# Altium schematic sheet [01] - MC.SchDoc
size A3
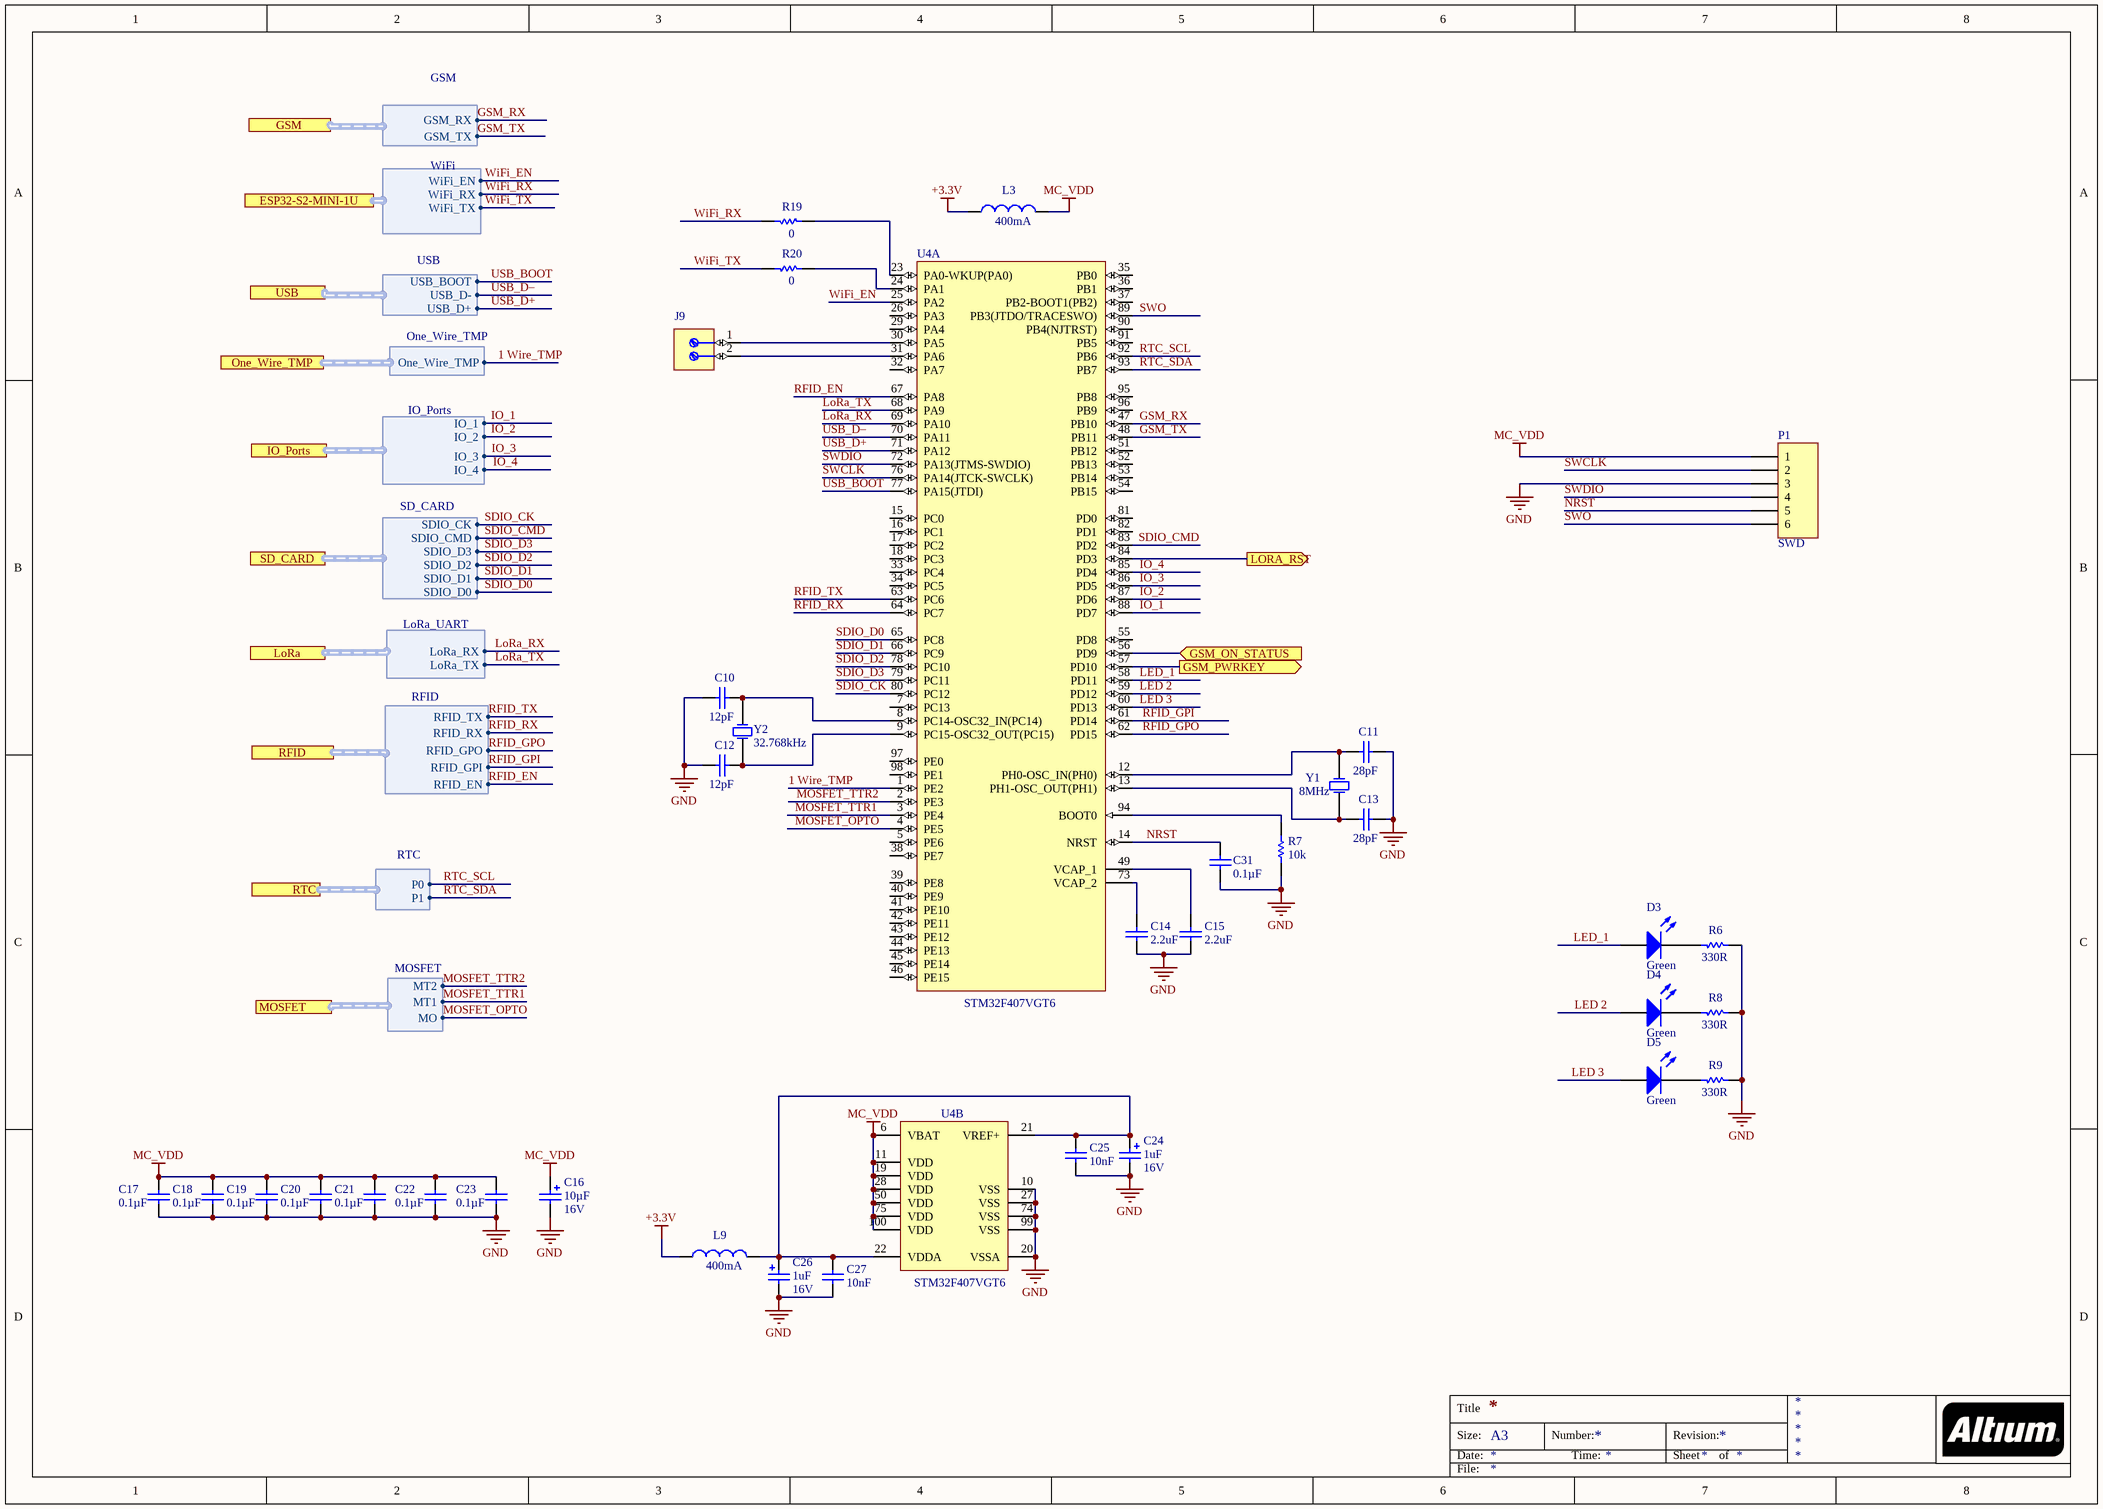
[diagram p0: [01] - MC.SchDoc]

## Parts
C10  Capacitance: 12pF  [Cap 0603]  (hidden comment: Capacitor)
C11  Capacitance: 28pF  [Cap 0603]  (hidden comment: Capacitor)
C12  Capacitance: 12pF  [Cap 0603]  (hidden comment: Capacitor)
C13  Capacitance: 28pF  [Cap 0603]  (hidden comment: Capacitor)
C14  Capacitance: 2.2uF  [Cap 0603]  (hidden comment: Capacitor)
C15  Capacitance: 2.2uF  [Cap 0603]  (hidden comment: Capacitor)
C16  Capacitance: 10µF  Voltage - Rated: 16V  [Tantalum 3216 A]  (hidden comment: Capacitor Polarized)
C17  Capacitance: 0.1µF  [Cap 0603]  (hidden comment: Capacitor)
C18  Capacitance: 0.1µF  [Cap 0603]  (hidden comment: Capacitor)
C19  Capacitance: 0.1µF  [Cap 0603]  (hidden comment: Capacitor)
C20  Capacitance: 0.1µF  [Cap 0603]  (hidden comment: Capacitor)
C21  Capacitance: 0.1µF  [Cap 0603]  (hidden comment: Capacitor)
C22  Capacitance: 0.1µF  [Cap 0603]  (hidden comment: Capacitor)
C23  Capacitance: 0.1µF  [Cap 0603]  (hidden comment: Capacitor)
C24  Capacitance: 1uF  Voltage Rating: 16V  [Tantalum 3216 A]  (hidden comment: Capacitor Polarized)
C25  Capacitance: 10nF  [Cap 0603]  (hidden comment: Capacitor)
C26  Capacitance: 1uF  Voltage Rating: 16V  [Tantalum 3216 A]  (hidden comment: Capacitor Polarized)
C27  Capacitance: 10nF  [Cap 0603]  (hidden comment: Capacitor)
C31  Capacitance: 0.1µF  [Cap 0603]  (hidden comment: Capacitor)
D3  Colour: Green  [Led 0805 green]  (hidden comment: LED)
D4  Colour: Green  [Led 0805 green]  (hidden comment: LED)
D5  Colour: Green  [Led 0805 green]  (hidden comment: LED)
J9  (no value)  [Connector -PHOENIX_1715721]
L3  Current Rating (Max): 400mA  [0603]  (hidden comment: Inductor)
L9  Current Rating (Max): 400mA  [0603]  (hidden comment: Inductor)
P1  SWD  [HDR1X6]
R6  Resistance: 330R  [Res-0603]  (hidden comment: Res1)
R7  Resistance: 10k  [Res-0603]  (hidden comment: Res1)
R8  Resistance: 330R  [Res-0603]  (hidden comment: Res1)
R9  Resistance: 330R  [Res-0603]  (hidden comment: Res1)
R19  Resistance: 0  [Res-0603]  (hidden comment: Res1)
R20  Resistance: 0  [Res-0603]  (hidden comment: Res1)
U4  Manufacturer Part Number: STM32F407VGT6  [LQFP100_N]  (hidden comment: STM32F407VGT6J)  (parts A,B of 2)
Y1  Frequency: 8MHz  [ABM3]  (hidden comment: XTAL2pin)
Y2  Frequency: 32.768kHz  [ECX-31B]  (hidden comment: 32768)

## Ports
ESP32-S2-MINI-1U (harness WiFi), GSM (harness GSM), GSM_ON_STATUS (in), GSM_PWRKEY (out), IO_Ports (harness IO_Ports), LoRa (harness LoRa_UART), LORA_RST (out), MOSFET (harness MOSFET), One_Wire_TMP (harness One_Wire_TMP), RFID (harness RFID), RTC (harness RTC), SD_CARD (harness SD_CARD), USB (harness USB)

## Harnesses
USB: USB_BOOT, USB_D+, USB_D-
SD_CARD: SDIO_CMD, SDIO_D0, SDIO_D1, SDIO_D2, SDIO_D3, SDIO_CK
WiFi: WiFi_EN, WiFi_RX, WiFi_TX
GSM: GSM_RX, GSM_TX
One_Wire_TMP: One_Wire_TMP
IO_Ports: IO_1, IO_2, IO_3, IO_4
LoRa_UART: LoRa_RX, LoRa_TX
RTC: P0, P1
RFID: RFID_TX, RFID_RX, RFID_GPO, RFID_GPI, RFID_EN
MOSFET: MO, MT1, MT2

## Nets
+3.3V: L3.1 L9.1
GND: C10.2 C11.2 C12.2 C13.2 C14.1 C15.1 C16.2 C17.1 C18.1 C19.1 C20.1 C21.1 C22.1 C23.1 C24.2 C25.1 C26.2 C27.1 C31.1 P1.3 R6.2 R7.1 R8.2 R9.2 U4.10(VSS) U4.20(VSSA) U4.27(VSS) U4.74(VSS) U4.99(VSS)
MC_VDD: C16.1 C17.2 C18.2 C19.2 C20.2 C21.2 C22.2 C23.2 L3.2 P1.1 U4.6(VBAT) U4.11(VDD) U4.19(VDD) U4.28(VDD) U4.50(VDD) U4.75(VDD) U4.100(VDD)
1 Wire_TMP: U4.1(PE2) ; port One_Wire_TMP.One_Wire_TMP
GSM_ON_STATUS: U4.56(PD9) ; port GSM_ON_STATUS
GSM_PWRKEY: U4.57(PD10) ; port GSM_PWRKEY
GSM_RX: U4.47(PB10) ; port GSM.GSM_RX
GSM_TX: U4.48(PB11) ; port GSM.GSM_TX
IO_1: U4.88(PD7) ; port IO_Ports.IO_1
IO_2: U4.87(PD6) ; port IO_Ports.IO_2
IO_3: U4.86(PD5) ; port IO_Ports.IO_3
IO_4: U4.85(PD4) ; port IO_Ports.IO_4
LED 2: D4.2(A) U4.59(PD12)
LED 3: D5.2(A) U4.60(PD13)
LED_1: D3.2(A) U4.58(PD11)
LORA_RST: U4.84(PD3) ; port LORA_RST
LoRa_RX: U4.69(PA10) ; port LoRa.LoRa_RX
LoRa_TX: U4.68(PA9) ; port LoRa.LoRa_TX
MOSFET_OPTO: U4.4(PE5) ; port MOSFET.MO
MOSFET_TTR1: U4.3(PE4) ; port MOSFET.MT1
MOSFET_TTR2: U4.2(PE3) ; port MOSFET.MT2
NRST: C31.2 P1.5 U4.14(NRST)
RFID_EN: U4.67(PA8) ; port RFID.RFID_EN
RFID_GPI: U4.61(PD14) ; port RFID.RFID_GPI
RFID_GPO: U4.62(PD15) ; port RFID.RFID_GPO
RFID_RX: U4.64(PC7) ; port RFID.RFID_RX
RFID_TX: U4.63(PC6) ; port RFID.RFID_TX
RTC_SCL: U4.92(PB6) ; port RTC.P0
RTC_SDA: U4.93(PB7) ; port RTC.P1
SDIO_CK: U4.80(PC12) ; port SD_CARD.SDIO_CK
SDIO_CMD: U4.83(PD2) ; port SD_CARD.SDIO_CMD
SDIO_D0: U4.65(PC8) ; port SD_CARD.SDIO_D0
SDIO_D1: U4.66(PC9) ; port SD_CARD.SDIO_D1
SDIO_D2: U4.78(PC10) ; port SD_CARD.SDIO_D2
SDIO_D3: U4.79(PC11) ; port SD_CARD.SDIO_D3
SWCLK: P1.2 U4.76(PA14(JTCK-SWCLK))
SWDIO: P1.4 U4.72(PA13(JTMS-SWDIO))
SWO: P1.6 U4.89(PB3(JTDO/TRACESWO))
USB_BOOT: U4.77(PA15(JTDI)) ; port USB.USB_BOOT
USB_D+: U4.71(PA12) ; port USB.USB_D+
USB_D–: U4.70(PA11) ; port USB.USB_D-
WiFi_EN: U4.25(PA2) ; port ESP32-S2-MINI-1U.WiFi_EN
WiFi_RX: R19.1 ; port ESP32-S2-MINI-1U.WiFi_RX
WiFi_TX: R20.1 ; port ESP32-S2-MINI-1U.WiFi_TX
NetC10_1: C10.1 U4.8(PC14-OSC32_IN(PC14)) Y2.2(OSC2)
NetC11_1: C11.1 U4.12(PH0-OSC_IN(PH0)) Y1.2(OSC2)
NetC12_1: C12.1 U4.9(PC15-OSC32_OUT(PC15)) Y2.1(OSC1)
NetC13_1: C13.1 U4.13(PH1-OSC_OUT(PH1)) Y1.1(OSC1)
NetC14_2: C14.2 U4.73(VCAP_2)
NetC15_2: C15.2 U4.49(VCAP_1)
NetC24_1: C24.1 C25.2 C26.1 C27.2 L9.2 U4.21(VREF+) U4.22(VDDA)
NetD3_1: D3.1(K) R6.1
NetD4_1: D4.1(K) R8.1
NetD5_1: D5.1(K) R9.1
NetJ9_1: J9.1 U4.30(PA5)
NetJ9_2: J9.2 U4.31(PA6)
NetR7_2: R7.2 U4.94(BOOT0)
NetR19_2: R19.2 U4.23(PA0-WKUP(PA0))
NetR20_2: R20.2 U4.24(PA1)

Not connected (* = marked no-connect by the designer): U4 5(PE6) 7(PC13) 15(PC0) 16(PC1) 17(PC2) 18(PC3) 26(PA3) 29(PA4) 32(PA7) 33(PC4) 34(PC5) 35(PB0) 36(PB1) 37(PB2-BOOT1(PB2)) 38(PE7) 39(PE8) 40(PE9) 41(PE10) 42(PE11) 43(PE12) 44(PE13) 45(PE14) 46(PE15) 51(PB12) 52(PB13) 53(PB14) 54(PB15) 55(PD8) 81(PD0) 82(PD1) 90(PB4(NJTRST)) 91(PB5) 95(PB8) 96(PB9) 97(PE0) 98(PE1)

## Notes on the sheet
- Title
- Size:
- Date:
- A3
- Number:
- Time:
- Revision:
- Sheet
- of
- File:

## Library data of the parts
C10 C12 = 1: Chip Capacitor Nonpolar; Manufacturer: KEMET; Manufacturer Part Number: C0603C120J5GAC-TU; Dielectric Material: Ceramic; Tolerance: 5%; Voltage Rating (DC): 50V; Dielectric: C0G; Temperature Coefficient: 30ppm/°C; Supplier 1: Digi-Key; Supplier Part Number 1: 399-1050-6-ND; Stock 1: 40000; Pricing 1: 1=0.1, 10=0.055, 100=0.0247, 500=0.01764, 1000=0.01385 (USD); Mount: Surface Mount,PCB; Case/Package: 0603; Number of Pins: 2; Weight: 7.1E-05oz; Case Code (Metric): 1608; Case Code (Imperial): 0603; Contact Material: Tin; Min Operating Temperature: -55°C; Max Operating Temperature: 125°C; Packaging: Tape and Reel; Termination: SMD/SMT; Voltage: 50V; Voltage Rating: 50V; Package Quantity: 1; Length: 1.6mm; Height: 0.8mm; Depth: 0.8mm; Width: 0.8mm; Thickness: 0.034inch; Lead Pitch: 0.7mm; Radiation Hardening: No; Lead Free: Lead Free; REACH SVHC: No SVHC; ComponentLink1URL: https://datasheet.ciiva.com/144/docfinderpartnumber-c0603c120j5gactu-144403.pdf; ComponentLink1Description: https://datasheet.ciiva.com/144/docfinderpartnumber-c0603c120j5gactu-144403.pdf; ComponentLink2URL: https://datasheet.ciiva.com/6136/1725436-6136442.pdf; ComponentLink2Description: https://datasheet.ciiva.com/6136/1725436-6136442.pdf; ComponentLink3URL: https://datasheet.ciiva.com/7823/1725436-7823611.pdf; ComponentLink3Description: https://datasheet.ciiva.com/7823/1725436-7823611.pdf; ComponentLink4URL: https://datasheet.ciiva.com/14589/70095383-14589483.pdf; ComponentLink4Description: https://datasheet.ciiva.com/14589/70095383-14589483.pdf; ComponentLink5URL: https://datasheet.ciiva.com/28608/1372242-28608539.pdf; ComponentLink5Description: https://datasheet.ciiva.com/28608/1372242-28608539.pdf; ComponentLink6URL: https://datasheet.ciiva.com/7823/1725436-7823612.pdf; ComponentLink6Description: https://datasheet.ciiva.com/7823/1725436-7823612.pdf; ComponentLink7URL: https://datasheet.ciiva.com/14610/70095383-14610590.pdf; ComponentLink7Description: https://datasheet.ciiva.com/14610/70095383-14610590.pdf; ComponentLink8URL: https://datasheet.ciiva.com/28645/1789732-28645662.pdf; ComponentLink8Description: https://datasheet.ciiva.com/28645/1789732-28645662.pdf
C11 C13 = 1: Chip Capacitor Nonpolar; Manufacturer: KEMET; Manufacturer Part Number: C0603C180K5GACTU; Dielectric Material: Ceramic; Tolerance: 10%; Voltage Rating (DC): 50V; Dielectric: C0G; Supplier 1: Digi-Key; Supplier Part Number 1: 399-7866-6-ND; Stock 1: 40000; Pricing 1: 1=0.1, 10=0.071, 100=0.0317, 500=0.02262, 1000=0.01777 (USD); Mount: Surface Mount; Case/Package: 0603; Case Code (Imperial): 0603; Case Code (Metric): 1608; Min Operating Temperature: -55°C; Max Operating Temperature: 125°C; Packaging: Tape and Reel; Voltage Rating: 50V; Package Quantity: 1; Termination: SMD/SMT; Length: 1.6mm; Height: 0.8mm; Depth: 0.8mm; Width: 0.031inch; Lead Pitch: 0.7mm; Thickness: 0.034inch; Radiation Hardening: No; Lead Free: Lead Free; REACH SVHC: No SVHC; ComponentLink1URL: http://www.mouser.com/ds/2/212/KEM_C1003_C0G_SMD-1101588.pdf; ComponentLink1Description: http://www.mouser.com/ds/2/212/KEM_C1003_C0G_SMD-1101588.pdf; ComponentLink2URL: https://search.kemet.com/component-edge/download/datasheet/C0603C180K5GACTU.pdf; ComponentLink2Description: https://search.kemet.com/component-edge/download/datasheet/C0603C180K5GACTU.pdf; ComponentLink3URL: https://api.kemet.com/component-edge/download/datasheet/C0603C180K5GACTU.pdf; ComponentLink3Description: https://api.kemet.com/component-edge/download/datasheet/C0603C180K5GACTU.pdf; ComponentLink4URL: http://components.arrow.com/part/dataview/2088557S6525245N7429; ComponentLink4Description: http://components.arrow.com/part/dataview/2088557S6525245N7429; ComponentLink5URL: http://capacitoredge.kemet.com/capedge2/DataSheet?pn=C0603C180K5GAC7867; ComponentLink5Description: http://capacitoredge.kemet.com/capedge2/DataSheet?pn=C0603C180K5GAC7867
C14 C15 = 1: Chip Capacitor Nonpolar; Manufacturer: Samsung; Manufacturer Part Number: CL21A225KAFNNNG; Material: Ceramic; Voltage Rating: 25V; Tolerance: 10%; ComponentLink1URL: http://www.kemet.com/docfinder?Partnumber=C0603C104K5RACTU; ComponentLink1Description: http://www.kemet.com/docfinder?Partnumber=C0603C104K5RACTU; Supplier 1: Digi-Key; Supplier Part Number 1: 1276-6458-6-ND; Stock 1: 8820; Pricing 1: 1=0.14, 10=0.103, 100=0.0458, 500=0.03268, 1000=0.02568 (USD); Mount: Surface Mount; Case/Package: 0805; Case Code (Metric): 2012; Case Code (Imperial): 0805; Min Operating Temperature: -55°C; Max Operating Temperature: 85°C; Package Quantity: 3000; Packaging: Tape and Reel; Length: 0.079inch; Width: 0.049inch; Thickness: 0.053inch; ComponentLink2URL: https://datasheet.ciiva.com/25730/cl21a225kafnnng-25730829.pdf; ComponentLink2Description: https://datasheet.ciiva.com/25730/cl21a225kafnnng-25730829.pdf; ComponentLink3URL: https://datasheet.ciiva.com/29199/455579-da-01-en-vs-kondensator-0805-29199247.pdf; ComponentLink3Description: https://datasheet.ciiva.com/29199/455579-da-01-en-vs-kondensator-0805-29199247.pdf
C16 = 2: Tantalum Capacitor; Manufacturer: Kemet; Manufacturer Part Number: T491A106K016AT; Manufacturer Size Code: A; Tolerance: ±10%; ESR (Equivalent Series Resistance): 7 Ohm; Type: Molded; Lifetime @ Temp.: 2000 Hrs @ 85°C; Supplier 1: Digi-Key; Supplier Part Number 1: 399-8269-1-ND; RoHS: RoHS Compliant; Category: Capacitors; Stock 1: 46669; Pricing 1: 1=0.41, 10=0.362, 50=0.2198, 100=0.181, 250=0.14476, 500=0.13184, 1000=0.11891 (USD); Packaging: Cut Tape (CT); Operating Temperature: -55°C ~ 125°C; Mounting Type: Surface Mount; Package / Case: 1206 (3216 Metric); Size / Dimension: 0.126" L x 0.063" W (3.20mm x 1.60mm); Height - Seated (Max): 0.071" (1.80mm); Lead Spacing: -; Features: General Purpose; ComponentLink1URL: http://www.kemet.com/Lists/ProductCatalog/Attachments/254/KEM_T2005_T491.pdf; ComponentLink1Description: http://www.kemet.com/Lists/ProductCatalog/Attachments/254/KEM_T2005_T491.pdf
C17-C23 C31 = 1: Chip Capacitor Nonpolar; Manufacturer: Kemet; Manufacturer Part Number: C0603C104K5RACTU; Tolerance: ±10%; Voltage - Rated: 50V; Temperature Coefficient: X7R; Supplier 1: Digi-Key; Supplier Part Number 1: 399-5089-1-ND; RoHS: RoHS Compliant; Category: Capacitors; Stock 1: 3992655; Pricing 1: 1=0.1, 10=0.041, 50=0.0222, 100=0.0187, 250=0.01532, 500=0.0131, 1000=0.0102 (USD); Packaging: Cut Tape (CT); Mounting Type: Surface Mount, MLCC; Operating Temperature: -55°C ~ 125°C; Applications: General Purpose; Ratings: -; Package / Case: 0603 (1608 Metric); Size / Dimension: 0.063" L x 0.031" W (1.60mm x 0.80mm); Height - Seated (Max): -; Thickness (Max): 0.034" (0.87mm); Lead Spacing: -; Features: -; Lead Style: -; ComponentLink1URL: http://www.kemet.com/docfinder?Partnumber=C0603C104K5RACTU; ComponentLink1Description: http://www.kemet.com/docfinder?Partnumber=C0603C104K5RACTU
C24 C26 = 2: Tantalum Capacitor; Manufacturer: Vishay Sprague; Manufacturer Part Number: 293D105X9016A2TE3; Tolerance: 10%; ESR (Equivalent Series Resistance): 9.3R; Ripple Current: 90mA; Leakage Current: 500nA; Polarity: Polar; Dissipation Factor: 4%; ComponentLink1URL: http://www.kemet.com/Lists/ProductCatalog/Attachments/254/KEM_T2005_T491.pdf; ComponentLink1Description: http://www.kemet.com/Lists/ProductCatalog/Attachments/254/KEM_T2005_T491.pdf; Supplier 1: Digi-Key; Supplier Part Number 1: 718-1113-6-ND; Stock 1: 0; Pricing 1: 1=0.33, 10=0.228, 100=0.1369, 500=0.1027, 1000=0.08672 (USD); Mount: Surface Mount,PCB; Case/Package: 1206; Case Code (Metric): 3216; Case Code (Imperial): 1206; Dielectric Material: Tantalum; Min Operating Temperature: -55°C; Max Operating Temperature: 125°C; Packaging: Tape and Reel; Package Quantity: 1; Voltage Rating (DC): 16V; Termination: SMD/SMT; Voltage: 16V; Features: General Purpose; Length: 3.2mm; Height: 1.6mm; Width: 1.6mm; Height - Seated (Max): 0.071inch; Depth: 1.6mm; Radiation Hardening: No; REACH SVHC: Unknown; Lead Free: Lead Free; ComponentLink2URL: https://datasheet.ciiva.com/11793/0900766b80d97b37-11793487.pdf; ComponentLink2Description: https://datasheet.ciiva.com/11793/0900766b80d97b37-11793487.pdf; ComponentLink3URL: https://datasheet.ciiva.com/26328/453930-da-01-en-smd-kondensator-293d105x9016a2te3-2000st-26328789.pdf; ComponentLink3Description: https://datasheet.ciiva.com/26328/453930-da-01-en-smd-kondensator-293d105x9016a2te3-2000st-26328789.pdf; ComponentLink4URL: https://datasheet.ciiva.com/257/293d-257909.pdf; ComponentLink4Description: https://datasheet.ciiva.com/257/293d-257909.pdf; ComponentLink5URL: https://datasheet.ciiva.com/257/293d-257910.pdf; ComponentLink5Description: https://datasheet.ciiva.com/257/293d-257910.pdf; ComponentLink6URL: https://datasheet.ciiva.com/16199/293d-16199270.pdf; ComponentLink6Description: https://datasheet.ciiva.com/16199/293d-16199270.pdf; ComponentLink7URL: https://datasheet.ciiva.com/257/293d-257911.pdf; ComponentLink7Description: https://datasheet.ciiva.com/257/293d-257911.pdf; ComponentLink8URL: https://datasheet.ciiva.com/3003/293d-3003799.pdf; ComponentLink8Description: https://datasheet.ciiva.com/3003/293d-3003799.pdf; ComponentLink9URL: https://datasheet.ciiva.com/11244/293d-11244087.pdf; ComponentLink9Description: https://datasheet.ciiva.com/11244/293d-11244087.pdf; ComponentLink10URL: https://datasheet.ciiva.com/46382/1910915-46382039.pdf; ComponentLink10Description: https://datasheet.ciiva.com/46382/1910915-46382039.pdf; ComponentLink11URL: https://datasheet.ciiva.com/3003/293d-3003800.pdf; ComponentLink11Description: https://datasheet.ciiva.com/3003/293d-3003800.pdf; ComponentLink12URL: https://datasheet.ciiva.com/18445/70212567-18445480.pdf; ComponentLink12Description: https://datasheet.ciiva.com/18445/70212567-18445480.pdf; ComponentLink13URL: https://datasheet.ciiva.com/1463/438417-1463146.pdf; ComponentLink13Description: https://datasheet.ciiva.com/1463/438417-1463146.pdf; ComponentLink14URL: https://datasheet.ciiva.com/12884/293d-239871-12884475.pdf; ComponentLink14Description: https://datasheet.ciiva.com/12884/293d-239871-12884475.pdf; ComponentLink15URL: https://datasheet.ciiva.com/22695/438417-22695102.pdf; ComponentLink15Description: https://datasheet.ciiva.com/22695/438417-22695102.pdf; ComponentLink16URL: https://datasheet.ciiva.com/6071/1748031-6071279.pdf; ComponentLink16Description: https://datasheet.ciiva.com/6071/1748031-6071279.pdf
C25 C27 = 1: Chip Capacitor Nonpolar; Manufacturer: Samsung; Manufacturer Part Number: CL10B103KB8WPNC; Voltage Rating: 50V; Tolerance: 10%; ComponentLink1URL: http://www.kemet.com/docfinder?Partnumber=C0603C104K5RACTU; ComponentLink1Description: http://www.kemet.com/docfinder?Partnumber=C0603C104K5RACTU; Supplier 1: Digi-Key; Supplier Part Number 1: 1276-6841-6-ND; Stock 1: 11590; Pricing 1: 1=0.1, 10=0.076, 100=0.0338, 500=0.02416, 1000=0.01898 (USD); Mount: Surface Mount; Case/Package: 0603; Case Code (Metric): 1608; Case Code (Imperial): 0603; Min Operating Temperature: -55°C; Max Operating Temperature: 125°C; Packaging: Tape and Reel; Length: 0.063inch; Width: 0.031inch; Thickness: 0.035inch; Lead Free: Lead Free
D3-D5 = 3: Led 0805; Manufacturer: Vishay Lite-On; Manufacturer Part Number: LTST-S220GKT; ID: 3; Lens Colour: Clear,Colorless; Viewing Angle: 130°; Lens Style: Clear,Diffused,Colorless,Rectangular; Luminous Intensity: 10mcd; Forward Voltage: 2.1V; Forward Current: 30mA; Power Rating: 100mW; Dominant Wavelength: 569nm; Test Current: 20mA; Lens Transparency: Clear; Number of Elements: 1; Wavelength: 565nm; Reverse Voltage: 5V; Supplier 1: Digi-Key; Supplier Part Number 1: 160-1218-6-ND; Stock 1: 87001; Pricing 1: 1=0.27, 10=0.199, 25=0.1464, 100=0.1045, 250=0.07108, 500=0.0627, 1000=0.04912 (USD); Mount: Surface Mount; Case/Package: 0805; Number of Pins: 2; Case Code (Metric): 2012; Case Code (Imperial): 0805; Min Operating Temperature: -55°C; Max Operating Temperature: 85°C; Package Quantity: 1; Packaging: Tape and Reel; Illumination Colour: Green; Power Dissipation: 100mW; Number of LEDs: 1; Length: 2.1mm; Height: 0.6mm; Width: 1mm; Depth: 0.6mm; Radiation Hardening: No; Lead Free: Lead Free; ComponentLink1URL: https://datasheet.ciiva.com/2110/ltst-s220gkt-2110016.pdf; ComponentLink1Description: https://datasheet.ciiva.com/2110/ltst-s220gkt-2110016.pdf; ComponentLink2URL: https://datasheet.ciiva.com/11775/0900766b80dc0b6e-11775442.pdf; ComponentLink2Description: https://datasheet.ciiva.com/11775/0900766b80dc0b6e-11775442.pdf; ComponentLink3URL: https://datasheet.ciiva.com/15118/getdatasheetpartid-221136-15118117.pdf; ComponentLink3Description: https://datasheet.ciiva.com/15118/getdatasheetpartid-221136-15118117.pdf; ComponentLink4URL: https://datasheet.ciiva.com/2110/ltst-s220gkt-2110017.pdf; ComponentLink4Description: https://datasheet.ciiva.com/2110/ltst-s220gkt-2110017.pdf; ComponentLink5URL: https://datasheet.ciiva.com/16444/ltst-s220gkt-16444773.pdf; ComponentLink5Description: https://datasheet.ciiva.com/16444/ltst-s220gkt-16444773.pdf
J9 = PHOENIX_1715721: Terminal Block, 2 Positions, Screw Connection; Part Description: 17.5A, 400V, Terminal Block, Pitch 5.08mm, 2 Positions, Screw Connection; Manufacturer: PHOENIX CONTACT; Manufacturer Part Number: 1715721 (MKDS 1,5/2-5,08); PressFit: No; Part Number: PHOENIX_1715721; Component Kind: Standard; Component Type: Standard; Footprint: PHOENIX_1715721; Pin Count: 2; Mounted: Yes; Socket: No; SMD: No; Sense: No; Status: None; ComponentHeight: 13.8mm; HelpURL: \\cern.ch\dfs\Applications\Altium\Datasheets\PHOENIX_1715721.pdf; Author: CERN DEM JLC; CreateDate: 06.01.2010; LatestRevisionDate: 25.02.2013
L3 L9 = 3: Sumida inductore ferrite core smd; Manufacturer: Murata Electronics North America; Manufacturer Part Number: BLM18AG102SN1D; Number of Lines: 1; Impedance @ Frequency: 1 kOhm @ 100MHz; DC Resistance (DCR) (Max): 500 mOhm; Supplier 1: Digi-Key; Supplier Part Number 1: 490-1015-1-ND; RoHS: RoHS Compliant; Category: Filters; Stock 1: 607561; Pricing 1: 1=0.1, 10=0.079, 50=0.0648, 100=0.0476, 250=0.0346, 500=0.0317, 1000=0.02738 (USD); Packaging: Cut Tape (CT); Filter Type: -; Ratings: -; Operating Temperature: -55°C ~ 125°C; Package / Case: 0603 (1608 Metric); Mounting Type: Surface Mount; Height (Max): 0.037" (0.95mm); Size / Dimension: 0.063" L x 0.031" W (1.60mm x 0.80mm); ComponentLink1URL: http://search.murata.co.jp/Ceramy/image/img/PDF/ENG/L0110S0100BLM18A.pdf; ComponentLink1Description: http://search.murata.co.jp/Ceramy/image/img/PDF/ENG/L0110S0100BLM18A.pdf
P1 = Header 6: Header, 6-Pin; LatestRevisionDate: 17-Jul-2002; LatestRevisionNote: Re-released for DXP Platform.; Publisher: Altium Limited
R6 R8 R9 R19 R20 = 1: Chip Resistor; Manufacturer: Panasonic; Manufacturer Part Number: ERJ-3EKF3300V; Tolerance: 1%; Power Rating: 100mW; Voltage Rating (DC): 75V; Temperature Coefficient: 100ppm/°C; ComponentLink1URL: http://industrial.panasonic.com/www-cgi/jvcr13pz.cgi?E+PZ+3+AOA0002+ERJ6ENF3000V+7+WW; ComponentLink1Description: http://industrial.panasonic.com/www-cgi/jvcr13pz.cgi?E+PZ+3+AOA0002+ERJ6ENF3000V+7+WW; Supplier 1: Digi-Key; Supplier Part Number 1: P330HDKR-ND; Stock 1: 924496; Pricing 1: 1=0.1, 10=0.079, 100=0.0323, 1000=0.01449, 2500=0.01258 (USD); Mount: Surface Mount; Case/Package: 0603; Number of Pins: 2; Weight: 7.1E-05oz; Case Code (Imperial): 0603; Case Code (Metric): 1608; Contact Plating: Tin; Min Operating Temperature: -55°C; Max Operating Temperature: 155°C; Packaging: Tape and Reel; Voltage Rating: 75V; Package Quantity: 1; Composition: Thick Film; Termination: SMD/SMT; Number of Terminations: 2; Military Standard: Not; Max Power Dissipation: 100mW; Features: Automotive AEC-Q200; Length: 1.6mm; Height: 0.022inch; Width: 0.8mm; Depth: 0.8mm; Radiation Hardening: No; REACH SVHC: No SVHC; Lead Free: Lead Free; ComponentLink2URL: https://datasheet.ciiva.com/7886/aoa0000ce2-7886729.pdf; ComponentLink2Description: https://datasheet.ciiva.com/7886/aoa0000ce2-7886729.pdf; ComponentLink3URL: https://datasheet.ciiva.com/48531/aoa0000ce2-48531001.pdf; ComponentLink3Description: https://datasheet.ciiva.com/48531/aoa0000ce2-48531001.pdf; ComponentLink4URL: https://datasheet.ciiva.com/22721/426256-22721099.pdf; ComponentLink4Description: https://datasheet.ciiva.com/22721/426256-22721099.pdf; ComponentLink5URL: https://datasheet.ciiva.com/46373/1678782-46373899.pdf; ComponentLink5Description: https://datasheet.ciiva.com/46373/1678782-46373899.pdf; ComponentLink6URL: https://datasheet.ciiva.com/9117/aoa0000ce2-9117132.pdf; ComponentLink6Description: https://datasheet.ciiva.com/9117/aoa0000ce2-9117132.pdf; ComponentLink7URL: https://datasheet.ciiva.com/46373/1678782-46373900.pdf; ComponentLink7Description: https://datasheet.ciiva.com/46373/1678782-46373900.pdf
R7 = 1: Chip Resistor; Manufacturer: Panasonic; Manufacturer Part Number: ERJ-3GEYJ103V; Tolerance: 5%; Power Rating: 100mW; Voltage Rating: 75V; Temperature Coefficient: 200ppm/°C; Voltage Rating (DC): 50V; Supplier 1: Digi-Key; Supplier Part Number 1: P10KGDKR-ND; Stock 1: 10740434; Pricing 1: 1=0.1, 10=0.054, 100=0.022, 1000=0.00988, 2500=0.00858 (USD); Mount: Surface Mount; Case/Package: 0603; Weight: 7.1E-05oz; Case Code (Imperial): 0603; Case Code (Metric): 1608; Contact Plating: Tin; Min Operating Temperature: -55°C; Max Operating Temperature: 155°C; Packaging: Tape and Reel; Package Quantity: 1; Composition: Thick Film; Termination: SMD/SMT; Number of Terminations: 2; Military Standard: Not; Max Power Dissipation: 100mW; Working Voltage: 75V; Features: Automotive AEC-Q200; Length: 1.6mm; Height: 0.45mm; Width: 0.8mm; Depth: 0.8mm; REACH SVHC: No SVHC; Lead Free: Lead Free; ComponentLink1URL: https://datasheet.ciiva.com/34303/2007265-34303757.pdf; ComponentLink1Description: https://datasheet.ciiva.com/34303/2007265-34303757.pdf; ComponentLink2URL: https://datasheet.ciiva.com/11809/0900766b80f806dd-11809566.pdf; ComponentLink2Description: https://datasheet.ciiva.com/11809/0900766b80f806dd-11809566.pdf; ComponentLink3URL: https://datasheet.ciiva.com/28514/1678796-28514213.pdf; ComponentLink3Description: https://datasheet.ciiva.com/28514/1678796-28514213.pdf; ComponentLink4URL: https://datasheet.ciiva.com/30147/4aoa0000ce1-30147029.pdf; ComponentLink4Description: https://datasheet.ciiva.com/30147/4aoa0000ce1-30147029.pdf; ComponentLink5URL: https://datasheet.ciiva.com/46371/1678796-46371909.pdf; ComponentLink5Description: https://datasheet.ciiva.com/46371/1678796-46371909.pdf; ComponentLink6URL: https://datasheet.ciiva.com/24133/aoa0000ce1-37422-24133064.pdf; ComponentLink6Description: https://datasheet.ciiva.com/24133/aoa0000ce1-37422-24133064.pdf; ComponentLink7URL: https://datasheet.ciiva.com/46385/1678796-46385240.pdf; ComponentLink7Description: https://datasheet.ciiva.com/46385/1678796-46385240.pdf; ComponentLink8URL: https://datasheet.ciiva.com/17212/aoa0000ce1-17212106.pdf; ComponentLink8Description: https://datasheet.ciiva.com/17212/aoa0000ce1-17212106.pdf; ComponentLink9URL: https://datasheet.ciiva.com/9117/aoa0000ce1-9117038.pdf; ComponentLink9Description: https://datasheet.ciiva.com/9117/aoa0000ce1-9117038.pdf; ComponentLink10URL: https://datasheet.ciiva.com/16740/aoa0000ce1-16740655.pdf; ComponentLink10Description: https://datasheet.ciiva.com/16740/aoa0000ce1-16740655.pdf; ComponentLink11URL: https://datasheet.ciiva.com/48531/aoa0000ce1-48531887.pdf; ComponentLink11Description: https://datasheet.ciiva.com/48531/aoa0000ce1-48531887.pdf
U4 = STM32F407VGT6J: ARM Cortex-M4 32-bit MCU+FPU, 210 DMIPS, 1024 kB Flash, 192 kB Internal RAM, 82 I/Os, 100-pin LQFP, -40 to 85 degC, Tray; Manufacturer: STMicroelectronics; Interface: I2C,SPI,USB,CAN,Ethernet,I2S,IrDA,UART,USART,LIN,EBI/EMI; Number of I/Os: 82; Number of Timers/Counters: 14; Frequency: 168MHz; RAM Size: 196KB; Number of ADC Channels: 16; Number of PWM Channels: 2; Number of Ethernet Channels: 1; Max Supply Voltage: 3.6V; Min Supply Voltage: 1.8V; Data Bus Width: 32b; Number of SPI Channels: 3; Watchdog Timer: Yes; Memory Size: 1024KB; Peripherals: Brown-out Detect/Reset,POR,PWM,WDT,DMA,LCD,I2C; ComponentLink1Description: Manufacturer URL; ComponentLink1URL: http://www.st.com/web/en/home.html; ComponentLink2Description: Datasheet; ComponentLink2URL: http://www.st.com/st-web-ui/static/active/en/resource/technical/document/datasheet/DM00037051.pdf; ComponentLink3Description: Package Specification; ComponentLink3URL: http://www.st.com/st-web-ui/static/active/en/resource/technical/document/data_brief/DM00071938.pdf; Supplier 1: Digi-Key; Supplier Part Number 1: 497-11605-ND; Stock 1: 9556; Pricing 1: 1=12.74, 10=11.713, 100=9.8925, 500=8.80006, 1000=8.07177 (USD); Case/Package: LQFP; Number of Pins: 100; Min Operating Temperature: -40°C; Max Operating Temperature: 85°C; Package Quantity: 90; Number of UART Channels: 2; Packaging: Tray; Number of Programmable I/O: 82; Oscillator Type: Internal; Max Frequency: 168MHz; Number of I2C Channels: 3; Address Bus Width: 32b; Memory Type: FLASH; Core Architecture: ARM; Length: 14.2mm; Height: 1.45mm; Width: 14.2mm; Radiation Hardening: No; REACH SVHC: No SVHC; Lead Free: Lead Free; ComponentLink4URL: https://datasheet.ciiva.com/14132/stm32f407vgt6-tds-eng-14132567.pdf; ComponentLink4Description: https://datasheet.ciiva.com/14132/stm32f407vgt6-tds-eng-14132567.pdf; ComponentLink5URL: https://datasheet.ciiva.com/4842/dm00037051-492832-4842280.pdf; ComponentLink5Description: https://datasheet.ciiva.com/4842/dm00037051-492832-4842280.pdf; ComponentLink6URL: https://datasheet.ciiva.com/48687/001075599-da-01-en-mcu-32bt-1mb-stm32f407vgt6-lqfp-100-stm-48687547.pdf; ComponentLink6Description: https://datasheet.ciiva.com/48687/001075599-da-01-en-mcu-32bt-1mb-stm32f407vgt6-lqfp-100-stm-48687547.pdf
Y1 = 1: Crystal Oscillator; Manufacturer: Abracon Corporation; Manufacturer Part Number: ABM3-8.000MHZ-D2Y-T; ID: 1; Tolerance: 20ppm; Load Capacitance: 18pF; ESR (Equivalent Series Resistance): 500R; Frequency Stability: 30ppm; LatestRevisionDate: 02-Jul-2014; Publisher: Ruslan Gimazetdinov; Supplier 1: Digi-Key; Supplier Part Number 1: 535-10630-1-ND; Supplier 2: Digi-Key; Supplier Part Number 2: 535-10630-6-ND; Stock 2: 119467; Pricing 2: 1=0.63, 10=0.523, 50=0.4702, 100=0.418, 500=0.3971 (USD); Mount: Surface Mount; Case/Package: CSMD; Number of Pins: 2; Min Operating Temperature: -40°C; Max Operating Temperature: 85°C; Packaging: Tape and Reel; Package Quantity: 1000; Frequency Tolerance: 20ppm; Termination: SMD/SMT; Composition: Ceramic; Series Resistance: 500R; Length: 5mm; Height: 0.051inch; Width: 3.2mm; Depth: 3.2mm; Radiation Hardening: No; REACH SVHC: Unknown; Lead Free: Lead Free; ComponentLink1URL: https://datasheet.ciiva.com/4945/abm3-47699-4945424.pdf; ComponentLink1Description: https://datasheet.ciiva.com/4945/abm3-47699-4945424.pdf; ComponentLink2URL: https://datasheet.ciiva.com/862/abm3-862465.pdf; ComponentLink2Description: https://datasheet.ciiva.com/862/abm3-862465.pdf; ComponentLink3URL: https://datasheet.ciiva.com/862/abm3-862466.pdf; ComponentLink3Description: https://datasheet.ciiva.com/862/abm3-862466.pdf; ComponentLink4URL: https://datasheet.ciiva.com/862/abm3-862467.pdf; ComponentLink4Description: https://datasheet.ciiva.com/862/abm3-862467.pdf; ComponentLink5URL: https://datasheet.ciiva.com/1357/1754353-1357270.pdf; ComponentLink5Description: https://datasheet.ciiva.com/1357/1754353-1357270.pdf; ComponentLink6URL: https://datasheet.ciiva.com/3174/abm3-3174137.pdf; ComponentLink6Description: https://datasheet.ciiva.com/3174/abm3-3174137.pdf; ComponentLink7URL: https://datasheet.ciiva.com/26812/getdatasheetpartid-723821-26812186.pdf; ComponentLink7Description: https://datasheet.ciiva.com/26812/getdatasheetpartid-723821-26812186.pdf; ComponentLink8URL: https://datasheet.ciiva.com/5788/abm3-5788043.pdf; ComponentLink8Description: https://datasheet.ciiva.com/5788/abm3-5788043.pdf; ComponentLink9URL: https://datasheet.ciiva.com/16392/abm3-16392475.pdf; ComponentLink9Description: https://datasheet.ciiva.com/16392/abm3-16392475.pdf; ComponentLink10URL: https://datasheet.ciiva.com/7998/abm3-7998589.pdf; ComponentLink10Description: https://datasheet.ciiva.com/7998/abm3-7998589.pdf
Y2 = 1: Crystal Oscillator; Manufacturer: ECS International; Manufacturer Part Number: ECS-.327-12.5-34B-TR; Load Capacitance: 12.5pF; ESR (Equivalent Series Resistance): 70kR; Frequency Tolerance: 20ppm; Supplier 1: Digi-Key; Supplier Part Number 1: XC1617DKR-ND; Stock 1: 274347; Pricing 1: 1=0.54, 10=0.448, 50=0.4034, 100=0.3586, 500=0.34068, 1000=0.28688 (USD); Mount: Surface Mount; Case/Package: SMD/SMT; Number of Pins: 2; Min Operating Temperature: -40°C; Max Operating Temperature: 85°C; Packaging: Tape and Reel; Package Quantity: 3000; Termination: SMD/SMT; Length: 0.126inch; Height: 0.035inch; Width: 0.059inch; ComponentLink1URL: http://www.ecsxtal.com/store/pdf/partnumber4.pdf; ComponentLink1Description: http://www.ecsxtal.com/store/pdf/partnumber4.pdf; ComponentLink2URL: http://www.mouser.com/ds/2/122/ecx-31b-1108368.pdf; ComponentLink2Description: http://www.mouser.com/ds/2/122/ecx-31b-1108368.pdf